# Altium project SAMW25_Xplained_Pro.PrjPCB (part 1 of 2)
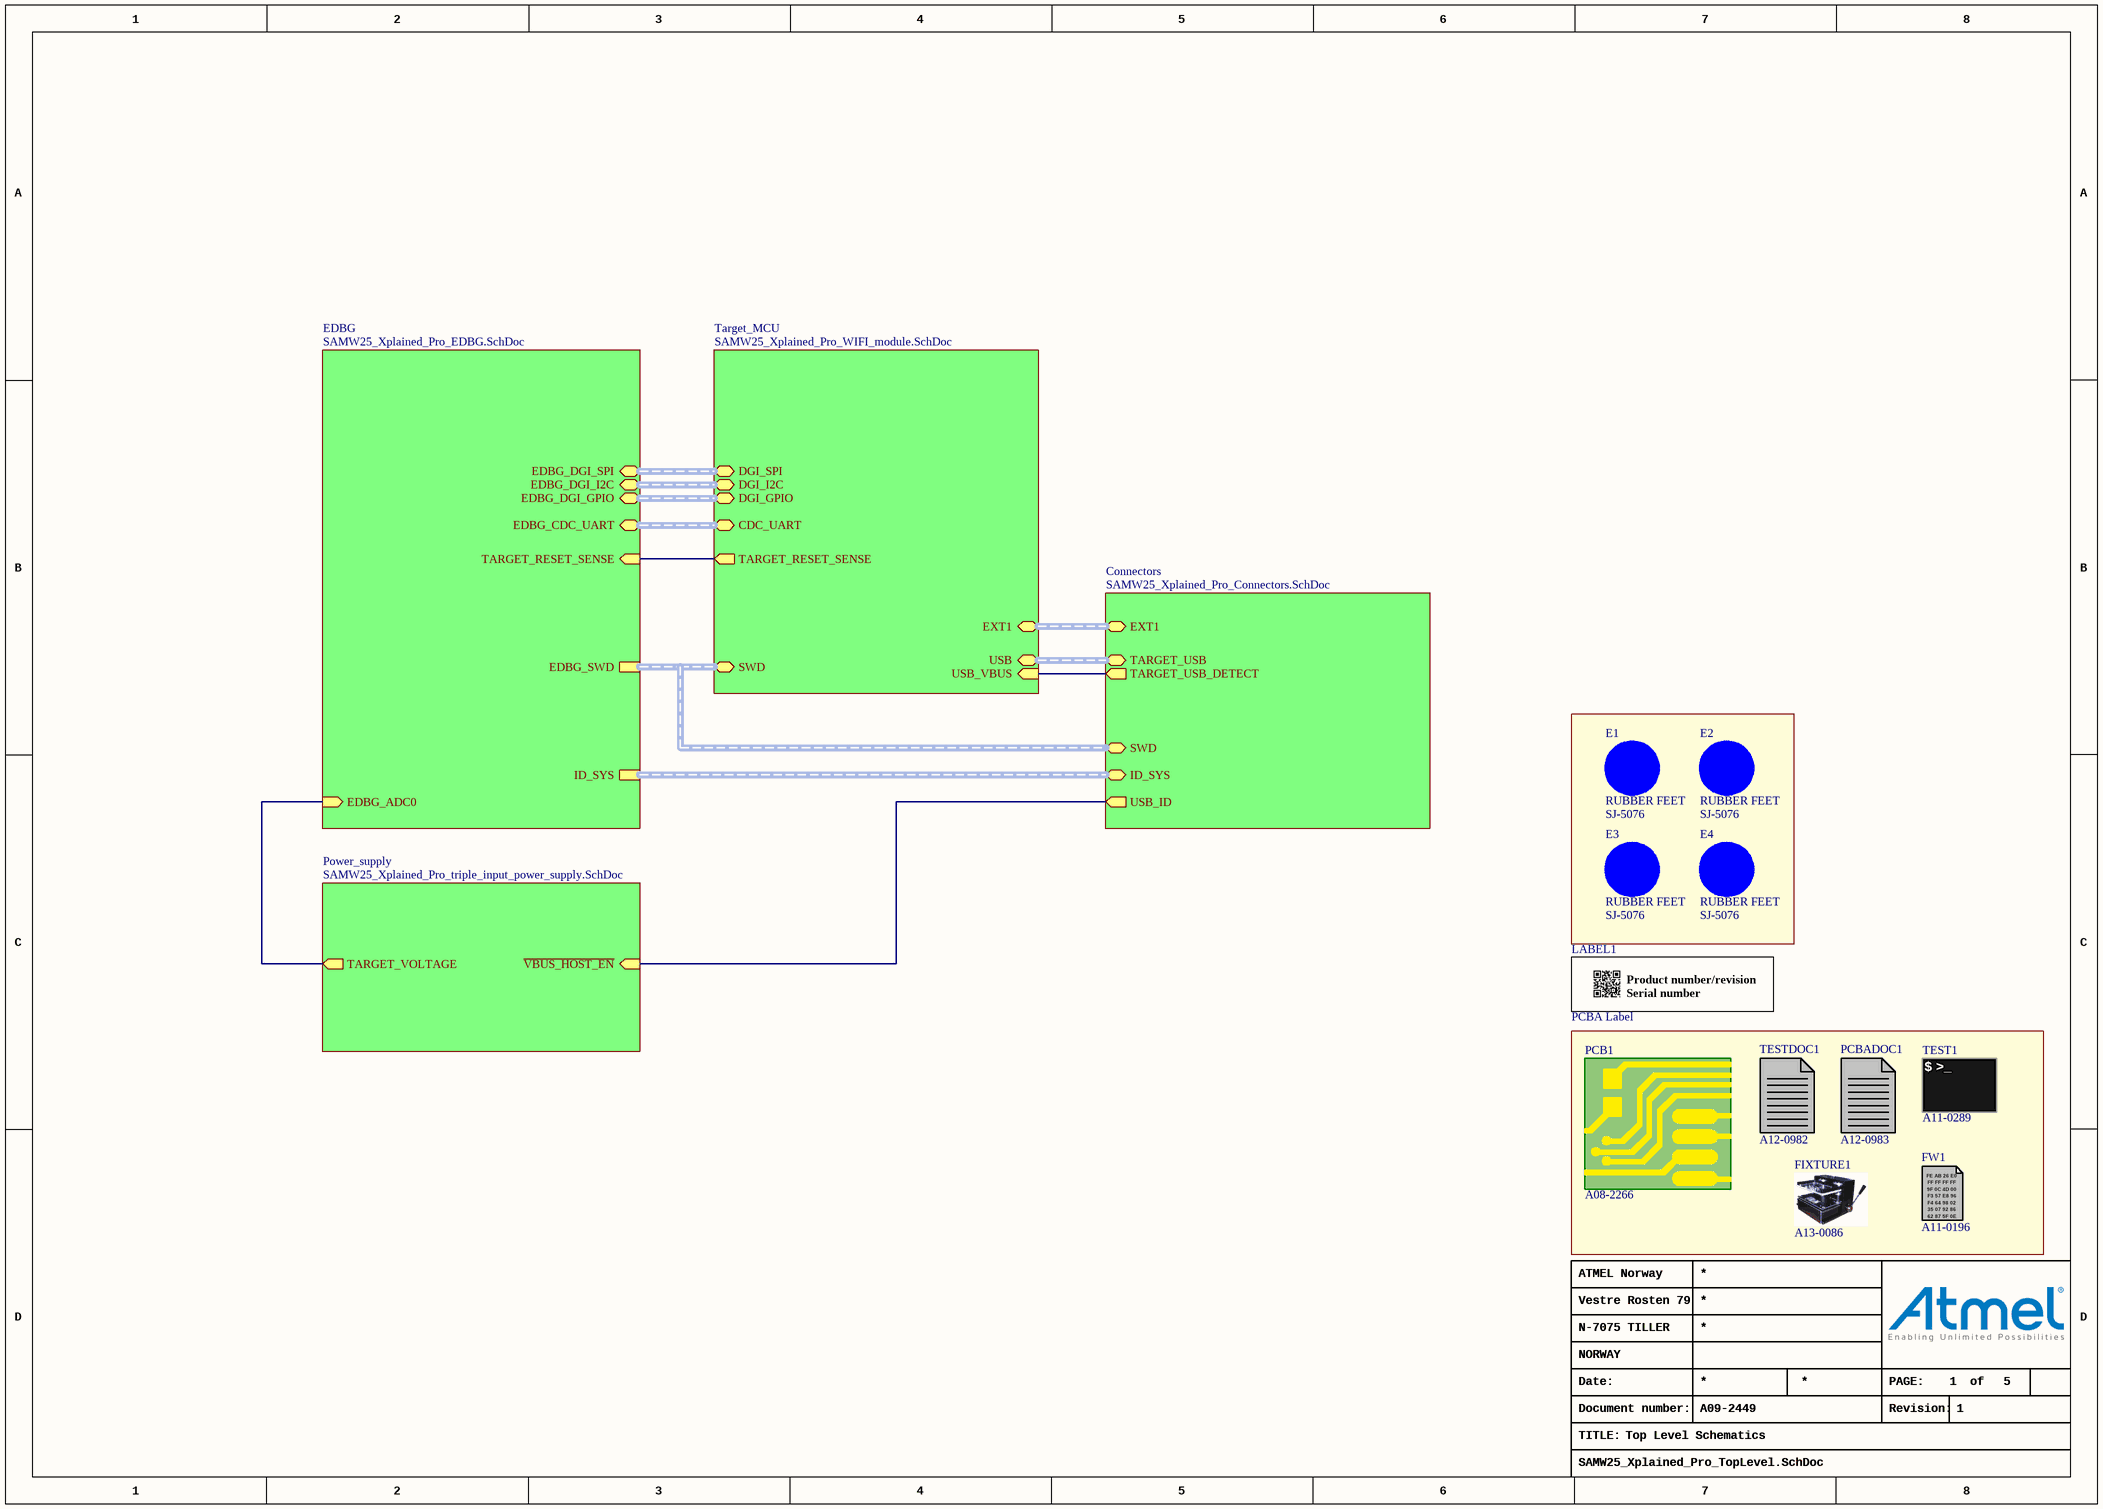
[diagram p0: SAMW25_Xplained_Pro_TopLevel.SchDoc]
5 sheets, 145 parts. Net scope: hierarchical (ports join the sheet entries above them; power ports are global).
Board file: SAMW25_Xplained_Pro.PcbDoc
Sheets:
  SAMW25_Xplained_Pro_TopLevel.SchDoc
    Target_MCU = SAMW25_Xplained_Pro_WIFI_module.SchDoc
    EDBG = SAMW25_Xplained_Pro_EDBG.SchDoc
    Connectors = SAMW25_Xplained_Pro_Connectors.SchDoc
    Power_supply = SAMW25_Xplained_Pro_triple_input_power_supply.SchDoc

## Sheet SAMW25_Xplained_Pro_TopLevel.SchDoc: Top Level Schematics
size A3; Organization: ATMEL Norway; Address1: Vestre Rosten 79; Address2: N-7075 TILLER; Address3: NORWAY; DocumentNumber: A09-2449; Revision: 1; SheetNumber: 1; SheetTotal: 5; PageSetup: Record=PageOptions|CenterHorizontal=True|CenterVertical=True|PrintScale=1.01|XCorrection=1.00|YCorrection=1.00|PrintKind=1|BorderSize=5000000|LeftOffset=0|BottomOffset=0|Orientation=2|PaperLength=1000|PaperWidth=1000|Scale=100|PaperSource=7|PrintQuality=-4|MediaType=1|DitherType=10|PaperKind=Letter|PrintScaleMode=1

### Parts
E1  RUBBER FEET  value SJ-5076  [AP8-00192]
E2  RUBBER FEET  value SJ-5076  [AP8-00192]
E3  RUBBER FEET  value SJ-5076  [AP8-00192]
E4  RUBBER FEET  value SJ-5076  [AP8-00192]
FIXTURE1  AN: A13-0086  (hidden comment: JIG)  (mechanical)
FW1  AN: A11-0196  (hidden comment: FW)  (mechanical)
LABEL1  value PCBA Label  [AP8-00317]  (hidden comment: PCBA_LABEL)
PCB1  AN: A08-2266  (hidden comment: PCB)  (mechanical)
PCBADOC1  AN: A12-0983  (hidden comment: PCBADOC)  (mechanical)
TEST1  AN: A11-0289  (hidden comment: TEST)  (mechanical)
TESTDOC1  AN: A12-0982  (hidden comment: TESTDOC)  (mechanical)

### Sub-sheets
Connectors = SAMW25_Xplained_Pro_Connectors.SchDoc: ID_SYS (harness ID_SYS), EXT1 (harness EXT), TARGET_USB (harness USB), TARGET_USB_DETECT (out), USB_ID (out), SWD (harness SWD)
EDBG = SAMW25_Xplained_Pro_EDBG.SchDoc: ID_SYS (harness ID_SYS), EDBG_SWD (harness SWD), EDBG_CDC_UART (harness CDC_UART), EDBG_DGI_I2C (harness DGI_I2C), EDBG_DGI_SPI (harness DGI_SPI), EDBG_DGI_GPIO (harness DGI_GPIO), TARGET_RESET_SENSE (in), EDBG_ADC0 (in)
Power_supply = SAMW25_Xplained_Pro_triple_input_power_supply.SchDoc: TARGET_VOLTAGE (out), ~{VBUS_HOST_EN} (in)
Target_MCU = SAMW25_Xplained_Pro_WIFI_module.SchDoc: SWD (harness SWD), DGI_SPI (harness DGI_SPI), DGI_I2C (harness DGI_I2C), DGI_GPIO (harness DGI_GPIO), CDC_UART (harness CDC_UART), TARGET_RESET_SENSE (out), EXT1 (harness EXT), USB (harness USB), USB_VBUS (in)

### Nets
EDBG_ADC0: sheet EDBG/EDBG_ADC0, sheet Power_supply/TARGET_VOLTAGE
PA05_ADC5: sheet Target_MCU/USB_VBUS, sheet Connectors/TARGET_USB_DETECT
TARGET_RESET_SENSE: sheet Target_MCU/TARGET_RESET_SENSE, sheet EDBG/TARGET_RESET_SENSE
TARGET_USB_ID: sheet Connectors/USB_ID, sheet Power_supply/~{VBUS_HOST_EN}

Not connected (* = marked no-connect by the designer): E1 1(FIDUCIAL); E2 1(FIDUCIAL); E3 1(FIDUCIAL); E4 1(FIDUCIAL)

### Buses and harness runs
harness sheet Connectors/EXT1 = sheet Target_MCU/EXT1
harness sheet Connectors/ID_SYS = sheet EDBG/ID_SYS
harness sheet Connectors/SWD = sheet EDBG/EDBG_SWD = sheet Target_MCU/SWD
harness sheet Connectors/TARGET_USB = sheet Target_MCU/USB
harness sheet EDBG/EDBG_CDC_UART = sheet Target_MCU/CDC_UART
harness sheet EDBG/EDBG_DGI_GPIO = sheet Target_MCU/DGI_GPIO
harness sheet EDBG/EDBG_DGI_I2C = sheet Target_MCU/DGI_I2C
harness sheet EDBG/EDBG_DGI_SPI = sheet Target_MCU/DGI_SPI

### Notes on the sheet
- Date:
- PAGE:
- of
- TITLE:
- Document number:
- Revision:
- (in symbol A09-0611) / Product number/revision / Serial number
- (in symbol A11-0196) FE AB 26 E0; FF FF FF FF; 9F 0C 4D 00; F3 57 E8 96; F4 64 98 02; 35 07 92 86; 62 87 5F 0E
- (in symbol A11-0289) $ >_

### Library data of the parts
E1-E4 = A08-0053: 2.8mm adhesive feet,diam 8.0mm; PartGroup: Mechanical devices,Mounting accessories; Manufacturer: 3M; ComponentStatus: 'Active (verified)'; Verified date: 2006-05-05; Verified by: Ketil Skjerve; Status: Active; AN: A08-0053; Height: 2,79999995231628; MPN: SJ-5076; FootprintStatus: 'Active (Verified)'
FIXTURE1 = A13-0086: Xplained PRO MCU board Jupiter Test Fixture; PartGroup: Test Equipment,Test Fixtures; Manufacturer: ESCATEC; ComponentStatus: 'Active (verified)'; Value: Xplained PRO MCU board Jupiter Test Fixture; MPN: Xplained PRO MCU board Jupiter Test Fixture
FW1 = A11-0196: EDBG secured firmware; PartGroup: Software,Firmware,Tools; Manufacturer: ATMEL; ComponentStatus: 'Active (verified)'; Value: EDBG secured firmware
LABEL1 = A09-0611: PCBA identification label PP Top White Gloss; PartGroup: Mechanical devices,Packaging materials,Printed Labels; Manufacturer: ACT Logimark AS; MPN: 505462; ComponentStatus: 'Active (verified)'; AN: A09-0611; Status: New; FootprintStatus: 'Active (Verified)'
PCB1 = A08-2266: SAM W25 Xplained Pro PCB documentation; PartGroup: Mechanical devices,Printed circuit boards; ComponentStatus: 'New (not verified)'; Value: SAM W25 Xplained Pro PCB documentation
PCBADOC1 = A12-0983: SAM W25 Xplained Pro PCBA documentation; PartGroup: Documentation,PCBA Documents,Atmel; Value: A09-2449 PCBA Files; ComponentStatus: 'New (not verified)'
TEST1 = A11-0289: Fixture test for SAM W25 Xplained Pro; PartGroup: Software,Test software,Starter Kit; Value: SAM W25 Xplained Pro test; ComponentStatus: 'New (not verified)'
TESTDOC1 = A12-0982: SAM W25 Xplained Pro test Instructions; PartGroup: Documentation,Procedures,Test Instructions; ComponentStatus: 'New (not verified)'; Value: SAM W25 Xplained Pro test Instructions

## Sheet SAMW25_Xplained_Pro_WIFI_module.SchDoc: Target MCU
size A3; Organization: ATMEL Norway; Address1: Vestre Rosten 79; Address2: N-7075 TILLER; Address3: NORWAY; DocumentNumber: A09-2449; Revision: 1; SheetNumber: 3; SheetTotal: 5; PageSetup: Record=PageOptions|CenterHorizontal=True|CenterVertical=True|PrintScale=1.01|XCorrection=1.00|YCorrection=1.00|PrintKind=1|BorderSize=5000000|LeftOffset=0|BottomOffset=0|Orientation=2|PaperLength=1000|PaperWidth=1000|Scale=100|PaperSource=7|PrintQuality=-4|MediaType=1|DitherType=10|PaperKind=A3 (297 x 420 mm)|PrintScaleMode=1
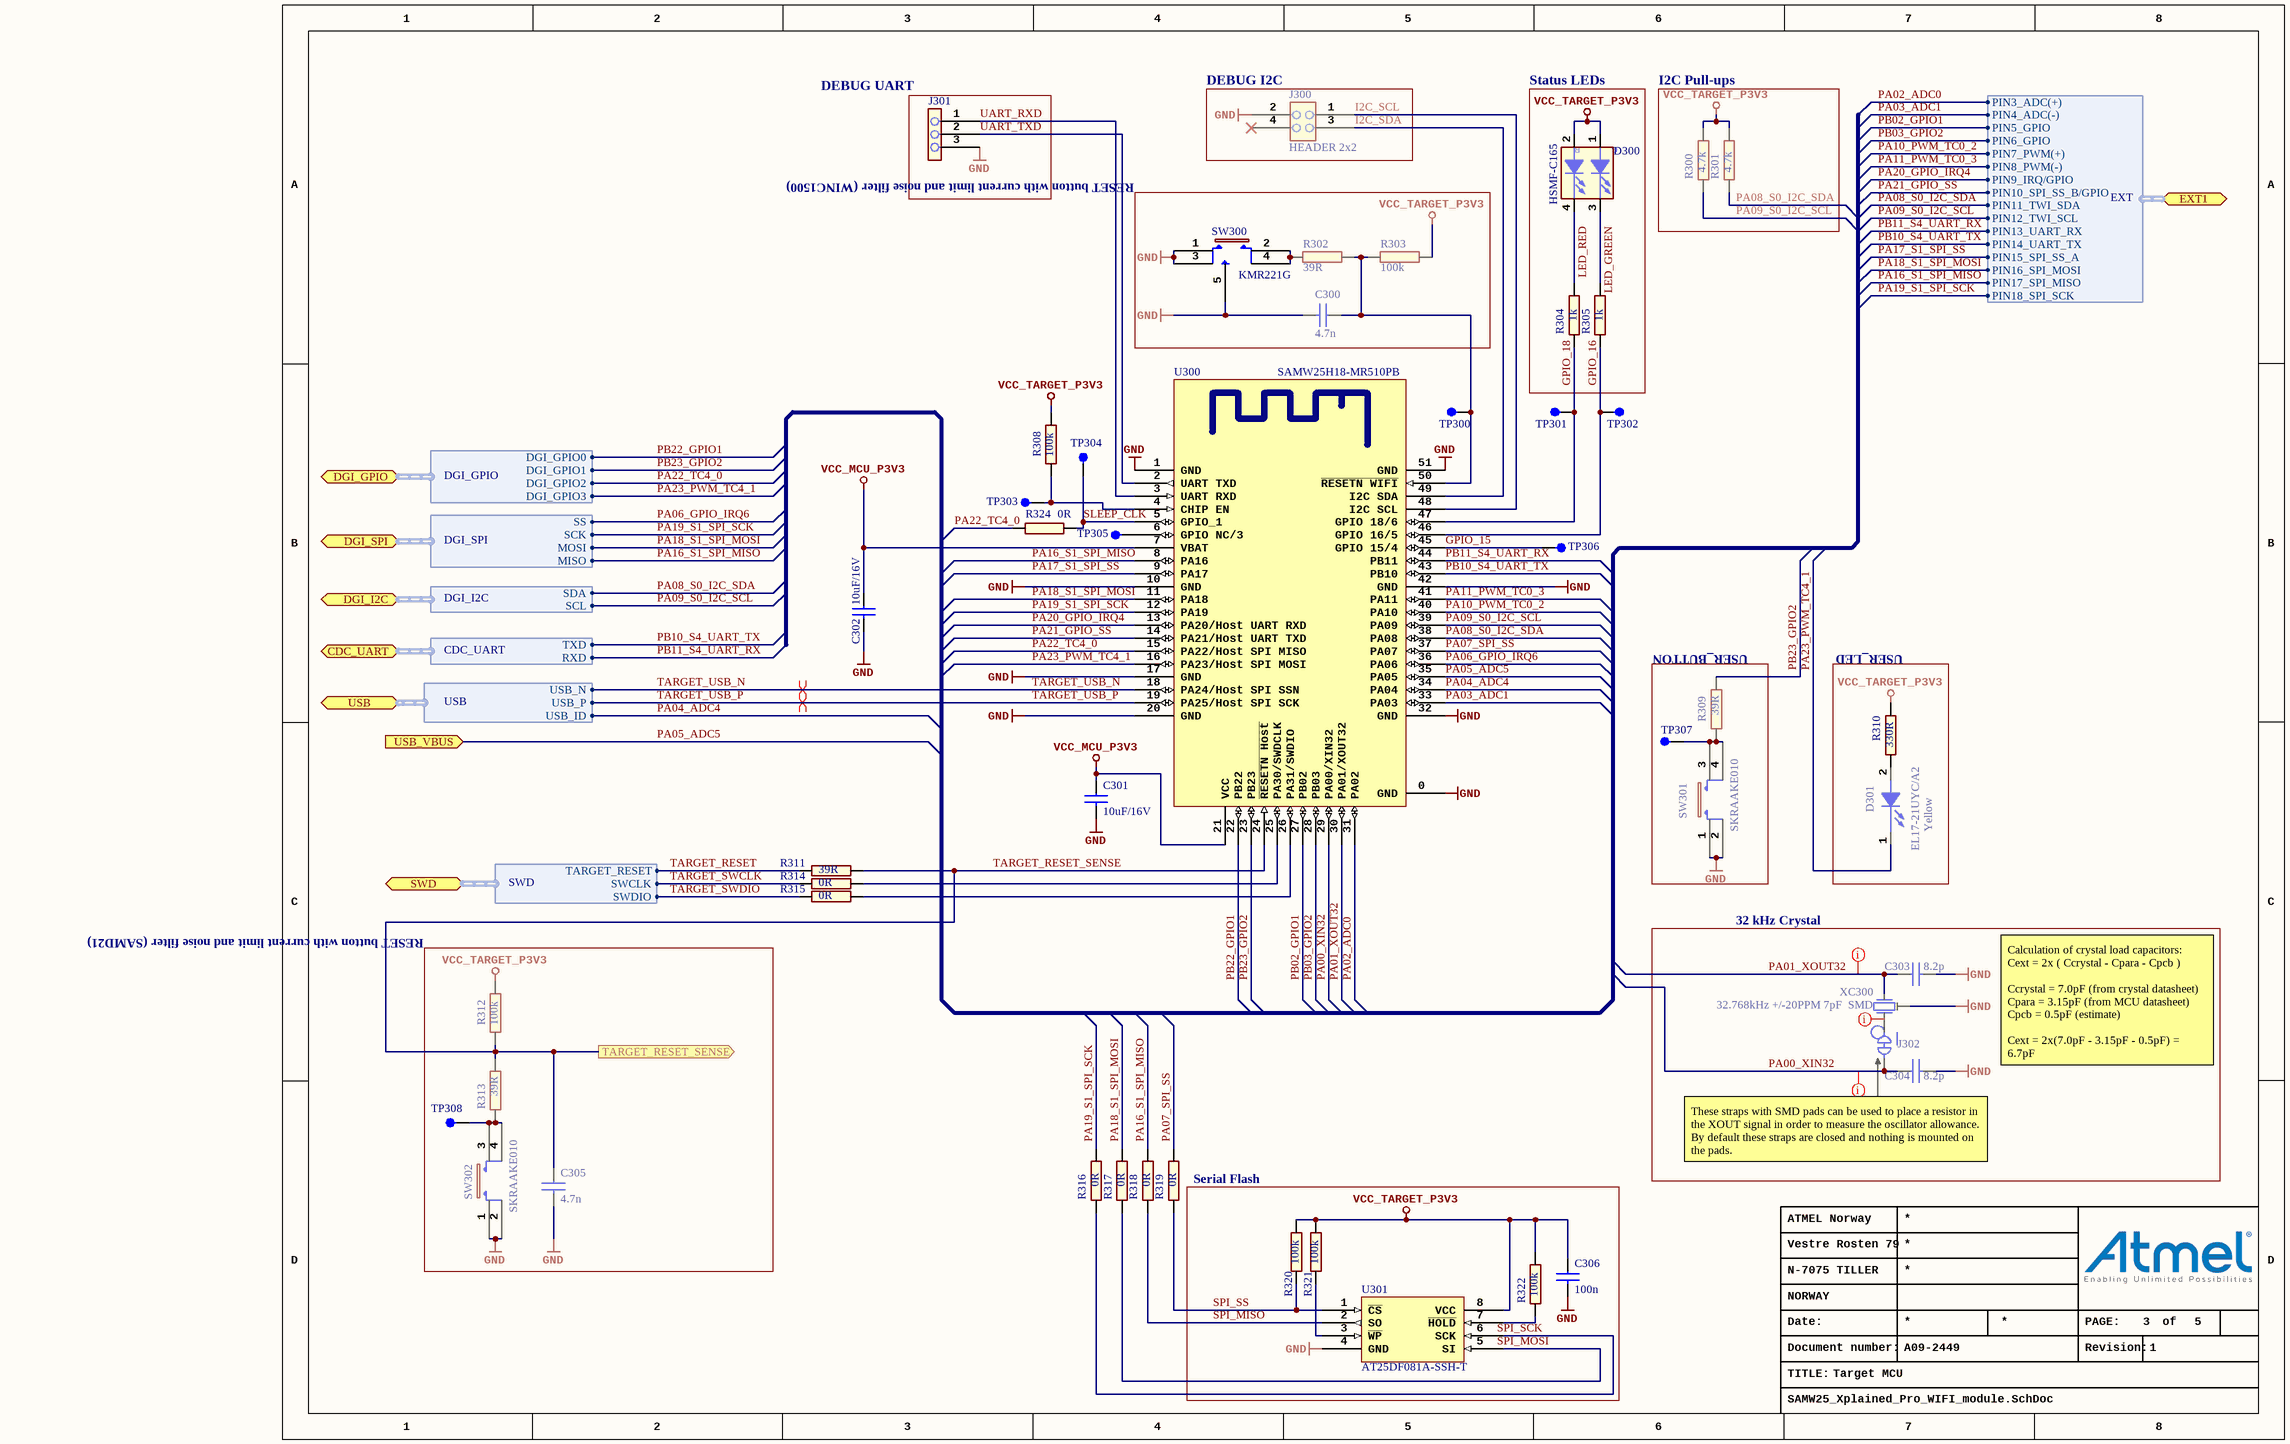
[diagram p1: SAMW25_Xplained_Pro_WIFI_module.SchDoc]

### Parts
C300  4.7n  [AP1-00001]
C301  value 10uF/16V  [AP1-00039]  (hidden comment: CAP-NONPOL)
C302  value 10uF/16V  [AP1-00039]  (hidden comment: CAP-NONPOL)
C303  value 8.2p  [AP1-00001]  (hidden comment: CAP-NONPOL)
C304  value 8.2p  [AP1-00001]  (hidden comment: CAP-NONPOL)
C305  4.7n  [AP1-00053]
C306  100n  [AP1-00001]
D300  value HSMF-C165  [AP4-00132]  (hidden comment: LED2_2)
D301  Yellow  value EL17-21UYC/A2  [AP4-00013]
J300  HEADER 2x2  [AP8-00179]
J301  Same as A08-1614 but with 1mm hole for optimal reflow soldering (no misalignment of the component)  [AP8-00745]  (value not drawn)
J302  SMD-STRAP_CLOSED  [AP8-00595]  (value not drawn)  (net tie, no BOM)
R300  value 4.7k  [AP2-00000]  (hidden comment: R2)
R301  value 4.7k  [AP2-00000]  (hidden comment: R2)
R302  value 39R  [AP2-00000]  (hidden comment: R2)
R303  value 100k  [AP2-00000]  (hidden comment: R2)
R304  value 1k  [AP2-00000]  (hidden comment: R2)
R305  value 1k  [AP2-00000]  (hidden comment: R2)
R308  value 100k  [AP2-00000]  (hidden comment: R2)
R309  value 39R  [AP2-00011]  (hidden comment: R2)
R310  value 330R  [AP2-00000]  (hidden comment: R2)
R311  value 39R  [AP2-00011]  (hidden comment: R2)
R312  value 100k  [AP2-00011]  (hidden comment: R2)
R313  value 39R  [AP2-00011]  (hidden comment: R2)
R314  value 0R  [AP2-00000]  (hidden comment: R2)
R315  value 0R  [AP2-00000]  (hidden comment: R2)
R316  value 0R  [AP2-00000]  (hidden comment: R2)
R317  value 0R  [AP2-00000]  (hidden comment: R2)
R318  value 0R  [AP2-00000]  (hidden comment: R2)
R319  value 0R  [AP2-00000]  (hidden comment: R2)
R320  value 100k  [AP2-00000]  (hidden comment: R2)
R321  value 100k  [AP2-00000]  (hidden comment: R2)
R322  value 100k  [AP2-00000]  (hidden comment: R2)
R324  value 0R  [AP2-00011]  (hidden comment: R2)
SW300  value KMR221G  [AP8-00274]  (hidden comment: PUSHBUTTON2)
SW301  value SKRAAKE010  [AP8-00137]  (hidden comment: Can be ordered in low volumes from Mouser)
SW302  value SKRAAKE010  [AP8-00137]  (hidden comment: Can be ordered in low volumes from Mouser)
TP300  TESTPOINT  [AP8-00256]  (value not drawn)  (no BOM)
TP301  TESTPOINT  [AP8-00256]  (value not drawn)  (no BOM)
TP302  TESTPOINT  [AP8-00256]  (value not drawn)  (no BOM)
TP303  TESTPOINT  [AP8-00256]  (value not drawn)  (no BOM)
TP304  TESTPOINT  [AP8-00256]  (value not drawn)  (no BOM)
TP305  TESTPOINT  [AP8-00256]  (value not drawn)  (no BOM)
TP306  TESTPOINT  [AP8-00256]  (value not drawn)  (no BOM)
TP307  TESTPOINT  [AP8-00010]  (value not drawn)  (no BOM)
TP308  TESTPOINT  [AP8-00010]  (value not drawn)  (no BOM)
U300  value SAMW25H18-MR510PB  [AP9-00132]  (hidden comment: MR210PA)
U301  value AT25DF081A-SSH-T  [AP8-00417]  (hidden comment: AT25DF081A)
XC300  value 32.768kHz +/-20PPM 7pF  SMD  [AP7-00044]  (hidden comment: Farnell order no:1539364)

### Blocks framed on the sheet
DEBUG I2C: J300
Status LEDs: D300 R304 R305
I2C Pull-ups: R300 R301
RESET button with current limit and noise filter (WINC1500): C300 R302 R303 SW300
USER_BUTTON: R309 SW301 TP307
USER_LED: D301 R310
RESET button with current limit and noise filter (SAMD21): C305 R312 R313 SW302 TP308
32 kHz Crystal: C303 C304 J302 XC300
Serial Flash: C306 R320-R322 U301

### Ports
CDC_UART (harness CDC_UART), DGI_GPIO (harness DGI_GPIO), DGI_I2C (harness DGI_I2C), DGI_SPI (harness DGI_SPI), EXT1 (harness EXT), SWD (harness SWD), TARGET_RESET_SENSE (out), USB (harness USB), USB_VBUS (in)

### Harnesses
DGI_GPIO: DGI_GPIO0, DGI_GPIO1, DGI_GPIO2, DGI_GPIO3
DGI_SPI: MISO, MOSI, SCK, SS
DGI_I2C: SCL, SDA
CDC_UART: RXD, TXD
SWD: SWCLK, SWDIO, TARGET_RESET
USB: USB_ID, USB_N, USB_P
EXT: PIN10_SPI_SS_B/GPIO, PIN11_TWI_SDA, PIN12_TWI_SCL, PIN13_UART_RX, PIN14_UART_TX, PIN15_SPI_SS_A, PIN16_SPI_MOSI, PIN17_SPI_MISO, PIN18_SPI_SCK, PIN3_ADC(+), PIN4_ADC(-), PIN5_GPIO, PIN6_GPIO, PIN7_PWM(+), PIN8_PWM(-), PIN9_IRQ/GPIO

### Nets
GND: C300.2 C301.2 C302.2 C303.2 C304.2 C305.2 C306.2 J300.2 J301.3 SW300.1 SW300.3 SW300.5(GND) SW301.1 SW301.2 SW302.1 SW302.2 U300.0(GND) U300.1(GND) U300.10(GND) U300.17(GND) U300.20(GND) U300.32(GND) U300.42(GND) U300.51(GND) U301.4(GND) XC300.3
VCC_MCU_P3V3: C301.1 C302.1 U300.7(VBAT) U300.21(VCC)
VCC_TARGET_P3V3: C306.1 D300.1(ANODE1) D300.2(ANODE2) R300.1 R301.1 R303.2 R308.2 R310.2 R312.2 R320.1 R321.1 R322.2 U301.8(VCC)
GPIO_15: TP306.1 U300.45(GPIO_15/4)
GPIO_16: R305.2 TP302.1 U300.46(GPIO_16/5)
GPIO_18: R304.2 TP301.1 U300.47(GPIO_18/6)
I2C_SCL: J300.1 U300.48(I2C_SCL)
I2C_SDA: J300.3 U300.49(I2C_SDA)
LED_GREEN: D300.3(CATHODE3) R305.1
LED_RED: D300.4(CATHODE4) R304.1
PA00_XIN32: C304.1 J302.2 U300.29(PA00/XIN32)
PA01_XOUT32: C303.1 U300.30(PA01/XOUT32) XC300.1
PA02_ADC0: U300.31(PA02) ; port EXT1.PIN3_ADC(+)
PA03_ADC1: U300.33(PA03) ; port EXT1.PIN4_ADC(-)
PA04_ADC4: U300.34(PA04) ; port USB.USB_ID
PA05_ADC5: U300.35(PA05) ; port USB_VBUS
PA06_GPIO_IRQ6: U300.36(PA06) ; port DGI_SPI.SS  [project net EDBG_SPI_DGI_SS]
PA07_SPI_SS: R319.2 U300.37(PA07)
PA08_S0_I2C_SDA: R301.2 U300.38(PA08) ; port DGI_I2C.SDA, port EXT1.PIN11_TWI_SDA  [project net EDBG_DGI_SDA]
PA09_S0_I2C_SCL: R300.2 U300.39(PA09) ; port DGI_I2C.SCL, port EXT1.PIN12_TWI_SCL  [project net EDBG_DGI_SCL]
PA10_PWM_TC0_2: U300.40(PA10) ; port EXT1.PIN7_PWM(+)
PA11_PWM_TC0_3: U300.41(PA11) ; port EXT1.PIN8_PWM(-)
PA16_S1_SPI_MISO: R318.2 U300.8(PA16) ; port DGI_SPI.MISO, port EXT1.PIN17_SPI_MISO
PA17_S1_SPI_SS: U300.9(PA17) ; port EXT1.PIN15_SPI_SS_A
PA18_S1_SPI_MOSI: R317.2 U300.11(PA18) ; port DGI_SPI.MOSI, port EXT1.PIN16_SPI_MOSI  [project net EDBG_SPI_DGI_MOSI]
PA19_S1_SPI_SCK: R316.2 U300.12(PA19) ; port DGI_SPI.SCK, port EXT1.PIN18_SPI_SCK  [project net EDBG_SPI_DGI_SCK]
PA20_GPIO_IRQ4: U300.13(PA20/Host_UART_RXD) ; port EXT1.PIN9_IRQ/GPIO
PA21_GPIO_SS: U300.14(PA21/Host_UART_TXD) ; port EXT1.PIN10_SPI_SS_B/GPIO
PA22_TC4_0: R324.1 U300.15(PA22/Host_SPI_MISO) ; port DGI_GPIO.DGI_GPIO2
PA23_PWM_TC4_1: D301.1(CATHODE) U300.16(PA23/Host_SPI_MOSI) ; port DGI_GPIO.DGI_GPIO3
PB02_GPIO1: U300.27(PB02) ; port EXT1.PIN5_GPIO
PB03_GPIO2: U300.28(PB03) ; port EXT1.PIN6_GPIO
PB10_S4_UART_TX: U300.43(PB10) ; port CDC_UART.TXD, port EXT1.PIN14_UART_TX  [project net EDBG_CDC_USART_RX]
PB11_S4_UART_RX: U300.44(PB11) ; port CDC_UART.RXD, port EXT1.PIN13_UART_RX
PB22_GPIO1: U300.22(PB22) ; port DGI_GPIO.DGI_GPIO0
PB23_GPIO2: R309.2 U300.23(PB23) ; port DGI_GPIO.DGI_GPIO1
SLEEP_CLK: R324.2 TP304.1 U300.5(GPIO_1)
SPI_MISO: R318.1 U301.2(SO)
SPI_SS: R319.1 R320.2 U301.1(~{CS})
TARGET_RESET: R311.1 ; port SWD.TARGET_RESET
TARGET_RESET_SENSE: C305.1 R311.2 R312.1 R313.2 U300.24(~{RESETN_Host}) ; port TARGET_RESET_SENSE
TARGET_SWCLK: R314.1 ; port SWD.SWCLK  [project net SWCLK]
TARGET_SWDIO: R315.1 ; port SWD.SWDIO  [project net SWDIO]
TARGET_USB_N: U300.18(PA24/Host_SPI_SSN) ; port USB.USB_N
TARGET_USB_P: U300.19(PA25/Host_SPI_SCK) ; port USB.USB_P
UART_RXD: J301.1 U300.3(UART_RXD)
UART_TXD: J301.2 U300.2(UART_TXD)
NetC300_1: C300.1 R302.2 R303.1 TP300.1 U300.50(~{RESETN_WIFI})
NetD301_2: D301.2(ANODE) R310.1
NetJ302_1: J302.1 XC300.2
NetR302_1: R302.1 SW300.2 SW300.4
NetR308_1: R308.1 TP303.1 U300.4(CHIP_EN)
NetR309_1: R309.1 SW301.3 SW301.4 TP307.1
NetR313_1: R313.1 SW302.3 SW302.4 TP308.1
NetR314_2: R314.2 U300.25(PA30/SWDCLK)
NetR315_2: R315.2 U300.26(PA31/SWDIO)
NetR316_1: R316.1 U301.6(SCK)
NetR317_1: R317.1 U301.5(SI)
NetR321_2: R321.2 U301.3(~{WP})
NetR322_1: R322.1 U301.7(~{HOLD})
NetTP305_1: TP305.1 U300.6(GPIO_NC/3)

Not connected (* = marked no-connect by the designer): J300 4*

### Layout directives
rule Assembly Testpoint Usage [Testpoint - Not Allowed    Multiple - Not Allowed]: NetJ302_1, PA00_XIN32, PA01_XOUT32
differential pair; rule Assembly Testpoint Usage [Testpoint - Not Allowed    Multiple - Not Allowed]: TARGET_USB_N, TARGET_USB_P

### Notes on the sheet
- (near J301) DEBUG UART
- Calculation of crystal load capacitors:
  Cext = 2x ( Ccrystal - Cpara - Cpcb )
  Ccrystal = 7.0pF (from crystal datasheet)
  Cpara = 3.15pF (from MCU datasheet)
  Cpcb = 0.5pF (estimate)
  Cext = 2x(7.0pF - 3.15pF - 0.5pF) = 6.7pF
- These straps with SMD pads can be used to place a resistor in the XOUT signal in order to measure the oscillator allowance.
  By default these straps are closed and nothing is mounted on the pads.
- Labels drawn without touching a wire or pin: SPI_MOSI, SPI_SCK
- Date:
- PAGE:
- of
- TITLE:
- Document number:
- Revision:
- (in symbol A10-0154) R; G

### Library data of the parts
C300 C305 = A01-0539: Ceramic capacitor, SMD 0402, X7R, 16V, +/-10 %; PartGroup: Capacitors,Ceramic,SMD 0402; Manufacturer: NIC Components Corp.; MPN: NMC0402X7R472K25TRPF; TemperatureRange: -55°C to +125°C; ComponentStatus: 'Active (verified)'; Status: Active; Verified by: Lars Helge Mo; Verified date: 2005-12-15; AN: A01-0539; Value: 4.7n; Height: 0.600000023841858; FootprintStatus: 'Active (Verified)'
C301 C302 = A01-0491: Ceramic capacitor, SMD 0603, X5R, 16V, 10UF ± 20% (High Density); PartGroup: Capacitors,Ceramic,SMD 0603; Manufacturer: Taiyo Yuden; MPN: EMK107BBJ106MA-T; Tolerance: ­± 20%; TemperatureRange: -55°C to +85°C; ComponentStatus: 'Active (verified)'; Status: Active; Verified by: Lars Helge Mo; Verified date: 2005-12-15; AN: A01-0491; Height: 0.819999992847443; FootprintStatus: 'Active (Verified)'
C303 C304 = A01-0014: Ceramic capacitor, SMD 0402, NP0, 50V, +/-5%; PartGroup: Capacitors,Ceramic,SMD 0402; TemperatureRange: -55 - +125 deg C; ComponentStatus: 'Active (verified)'; Status: Active; Verified by: Lars Helge Mo; Verified date: 2005-12-15; AN: A01-0014; Tolerance: 50V, +/-5%; Height: 0.550000011920929; FootprintStatus: 'Active (Verified)'
C306 = A01-0246: Ceramic capacitor, SMD 0402, X7R, 16V, +/-10%; PartGroup: Capacitors,Ceramic,SMD 0402; Manufacturer: Kemet; MPN: C0402C104K4RACTU; TemperatureRange: -55 - +125 deg C; ComponentStatus: 'Active (verified)'; Status: Active; Verified by: Lars Helge Mo; Verified date: 2005-12-15; AN: A01-0246; Value: 100n; Tolerance: 16V, +/-10%; Height: 0,5; FootprintStatus: 'Active (Verified)'
D300 = A10-0154: LED, Bicolor, Red/Green, Diffused, 1.6 x 0.8 mm (0603); PartGroup: Opto,LEDs,SMD; Manufacturer: Avago Technologies; TemperatureRange: -30Â°C to 85Â°C; ComponentStatus: 'Active (verified)'; AN: A10-0154; Height: 0.5; MPN: HSMF-C165; FootprintStatus: 'Active (Verified)'
D301 = A10-0019: LED, Yellow, Wave length=591nm, SMD 0805, ±70°; PartGroup: Opto,LEDs,SMD; Manufacturer: Everlight; MPN: 17-21UYC/S530-A3/TR8; TemperatureRange: -40 to +85 deg C; ComponentStatus: 'Active (verified)'; Verified date: 2006-02-17; Verified by: Sveinung Helgeland; Status: Active; AN: A10-0019; Height: 1,10000002384186; FootprintStatus: 'Active (Verified)'
J300 = A08-0115: 2x2 pin header, 2.54 mm pitch, Pin-in-Paste THM; PartGroup: Mechanical devices,Connectors,Pin headers; Manufacturer: Freber; Value: CD0750142X2; ComponentStatus: 'Active (verified)'; Verified date: 2005-12-19; Verified by: Lars Helge Mo; Status: Active; AN: A08-0115; Height: 9.60000038146973; MPN: CD0750142X2; FootprintStatus: 'Active (Verified)'
J301 = A08-1799: 1x3 pin header, 2.54mm pitch, Pin-in-Paste THM, 1mm hole; PartGroup: Mechanical devices,Connectors,Pin headers; Manufacturer: SAMTEC; Value: HMTSW-103-23-F-S-237; ComponentStatus: 'Active (verified)'; Verified date: 2006-01-30; Verified by: Lars Helge Mo; Status: Active; AN: A08-1799; Height: 6.09999990463257; MPN: HMTSW-103-23-F-S-237; FootprintStatus: 'Active (Verified)'
J302 = A08-1454: Closed Link 0402; PartGroup: Mechanical devices,PCB implemented components; ComponentStatus: 'Active (verified)'; AN: A08-1454; Value: Closed Link; FootprintStatus: 'New (Not verified)'
R300 R301 = A02-0228: Thick film resistor, SMD 0402, 1/16W, 1%; PartGroup: Resistors,SMD,0402 1%; TemperatureRange: -55ï¿½ to +125ï¿½C; ComponentStatus: 'Active (verified)'; Status: Active; Verified by: Lars Helge Mo; Verified date: 2005-12-19; AN: A02-0228; Tolerance: 1 %; Height: 0,349999994039536; FootprintStatus: 'Active (Verified)'
R302 R309 R311 R313 = A02-0178: Thick film resistor, SMD 0402, 1/16W, 1%; PartGroup: Resistors,SMD,0402 1%; TemperatureRange: -55 - +125 deg C; ComponentStatus: 'Active (verified)'; Status: Active; Verified by: Lars Helge Mo; Verified date: 2005-12-19; AN: A02-0178; Tolerance: 1 %; Height: 0,349999994039536; FootprintStatus: 'Active (Verified)'
R303 R308 R312 R320-R322 = A02-0260: Thick film resistor, SMD 0402, 1/16W, 1%; PartGroup: Resistors,SMD,0402 1%; TemperatureRange: -55 - +125 deg C; ComponentStatus: 'Active (verified)'; Status: Active; Verified by: Lars Helge Mo; Verified date: 2005-12-19; AN: A02-0260; Tolerance: 1 %; Height: 0,349999994039536; FootprintStatus: 'Active (Verified)'
R304 R305 = A02-0212: Thick film resistor, SMD 0402, 1/16W, 1%; PartGroup: Resistors,SMD,0402 1%; TemperatureRange: -55 - +125 deg C; ComponentStatus: 'Active (verified)'; Status: Active; Verified by: Lars Helge Mo; Verified date: 2005-12-19; AN: A02-0212; Tolerance: 1 %; Height: 0.349999994039536; FootprintStatus: 'Active (Verified)'
R310 = A02-0200: Thick film resistor, SMD 0402, 1/16W, 1%; PartGroup: Resistors,SMD,0402 1%; TemperatureRange: -55 - +125 deg C; ComponentStatus: 'Active (verified)'; Status: Active; Verified by: Lars Helge Mo; Verified date: 2005-12-19; AN: A02-0200; Tolerance: 1 %; Height: 0.349999994039536; FootprintStatus: 'Active (Verified)'
R314-R319 = A02-0163: RES 0.0 OHM 1/16W 0402 SMD; PartGroup: Resistors,SMD,0402 1%; MPN: RMCF0402ZT0R00; Tolerance: 1 %; TemperatureRange: -55 - +125 deg C; ComponentStatus: 'Active (verified)'; Status: Active; Verified by: Lars Helge Mo; Verified date: 2005-12-19; AN: A02-0163; Height: 0.349999994039536; FootprintStatus: 'Active (Verified)'
R324 = A02-0163: Thick film resistor, SMD 0402, 1/16W, 1%; PartGroup: Resistors,SMD,0402 1%; TemperatureRange: -55 - +125 deg C; ComponentStatus: 'Active (verified)'; Status: Active; Verified by: Lars Helge Mo; Verified date: 2005-12-19; AN: A02-0163; Tolerance: 1 %; Height: 0.349999994039536; FootprintStatus: 'Active (Verified)'
SW300 = A08-0420: Microminiature Tact Switch for SMT; PartGroup: Mechanical devices,Switches,SMD; Manufacturer: ITT cannon; ComponentStatus: 'Active (verified)'; Status: Active; Verified by: Ketil Skjerve; Verified date: 2006-03-15; AN: A08-0420; Height: 1.89999997615814; MPN: KMR221G; FootprintStatus: 'Active (Verified)'
SW301 SW302 = A08-0790: 6.2x6.2 mm SMD tact switch, same as A08-0091 but less force is needed; PartGroup: Mechanical devices,Switches,SMD; Manufacturer: ALPS; TemperatureRange: -30 - +90 deg C; ComponentStatus: 'Active (verified)'; Status: Active; Verified by: Ketil Skjerve; Verified date: 2006-03-15; AN: A08-0790; Height: 5,09999990463257; MPN: SKRAAKE010; FootprintStatus: 'Active (Verified)'
TP300-TP306 = A09-0290: Hole for user grid with 1.27 mm pitch, 1x1 mm pad; PartGroup: Mechanical devices,PCB implemented components,PCB Screw Hole components; Value: Hole 0.65 mm; ComponentStatus: 'Active (verified)'; Status: Active; Verified by: Sveinung Helgeland; Verified date: 2006-02-17; AN: A09-0290; FootprintStatus: 'Active (Verified)'
TP307 TP308 = A08-0004: Single SMD testpad; PartGroup: Mechanical devices,Connectors,Test points; ComponentStatus: 'Active (verified)'; Status: Active; Verified by: Sveinung Helgeland; Verified date: 2006-02-17; AN: A08-0004; Height: 0; FootprintStatus: 'Active (Verified)'
U300 = A06-1267: IEEE 802.11 b/g/n module with onboard SAMD21G18A-MU and Crypto IC; PartGroup: Integrated Circuits,MCU, MPU, DSP,Other; Manufacturer: ATMEL; MPN: ATSAMW25H18-MR510PB; TemperatureRange: -20 to 85 C; ComponentStatus: 'Active (verified)'; AN: A06-1267; FootprintStatus: 'New (Not verified)'
U301 = A06-1051: 8Mbit SPI serial flash memory; PartGroup: Integrated Circuits,Memory,FLASH; Manufacturer: Adesto Technologies; TemperatureRange: -40°C to +85°C; ComponentStatus: 'Active (verified)'; AN: A06-1051; Height: 1.75; MPN: AT25DF081A-SSH-T; FootprintStatus: 'Active (Verified)'
XC300 = A07-0052: 32k768 crystal, +-20ppm, CL=7pF, max ESR 60kOhm, SMD; PartGroup: Frequency devices,Crystals,SMD; Manufacturer: Micro Crystal; MPN: MS1V-T1K 32.768kHz 7pF +/-20PPM TA; Tolerance: +/- 20 PPM; TemperatureRange: -40 /+85; ComponentStatus: 'Active (verified)'; AN: A07-0052; Height: 2,07999992370605; FootprintStatus: 'Active (Verified)'

## Sheet SAMW25_Xplained_Pro_EDBG.SchDoc: Embedded Debugger (EDBG)
size A3; Organization: ATMEL Norway; Address1: Vestre Rosten 79; Address2: N-7075 TILLER; Address3: NORWAY; DocumentNumber: A09-2449; Revision: 1; SheetNumber: 5; SheetTotal: 5; PageSetup: Record=PageOptions|CenterHorizontal=True|CenterVertical=True|PrintScale=0.73|XCorrection=1.00|YCorrection=1.00|PrintKind=1|BorderSize=5000000|LeftOffset=0|BottomOffset=0|Orientation=2|PaperLength=1000|PaperWidth=1000|Scale=100|PaperSource=7|PrintQuality=-4|MediaType=1|DitherType=10|PaperKind=A3 (297 x 420 mm)|PrintScaleMode=1
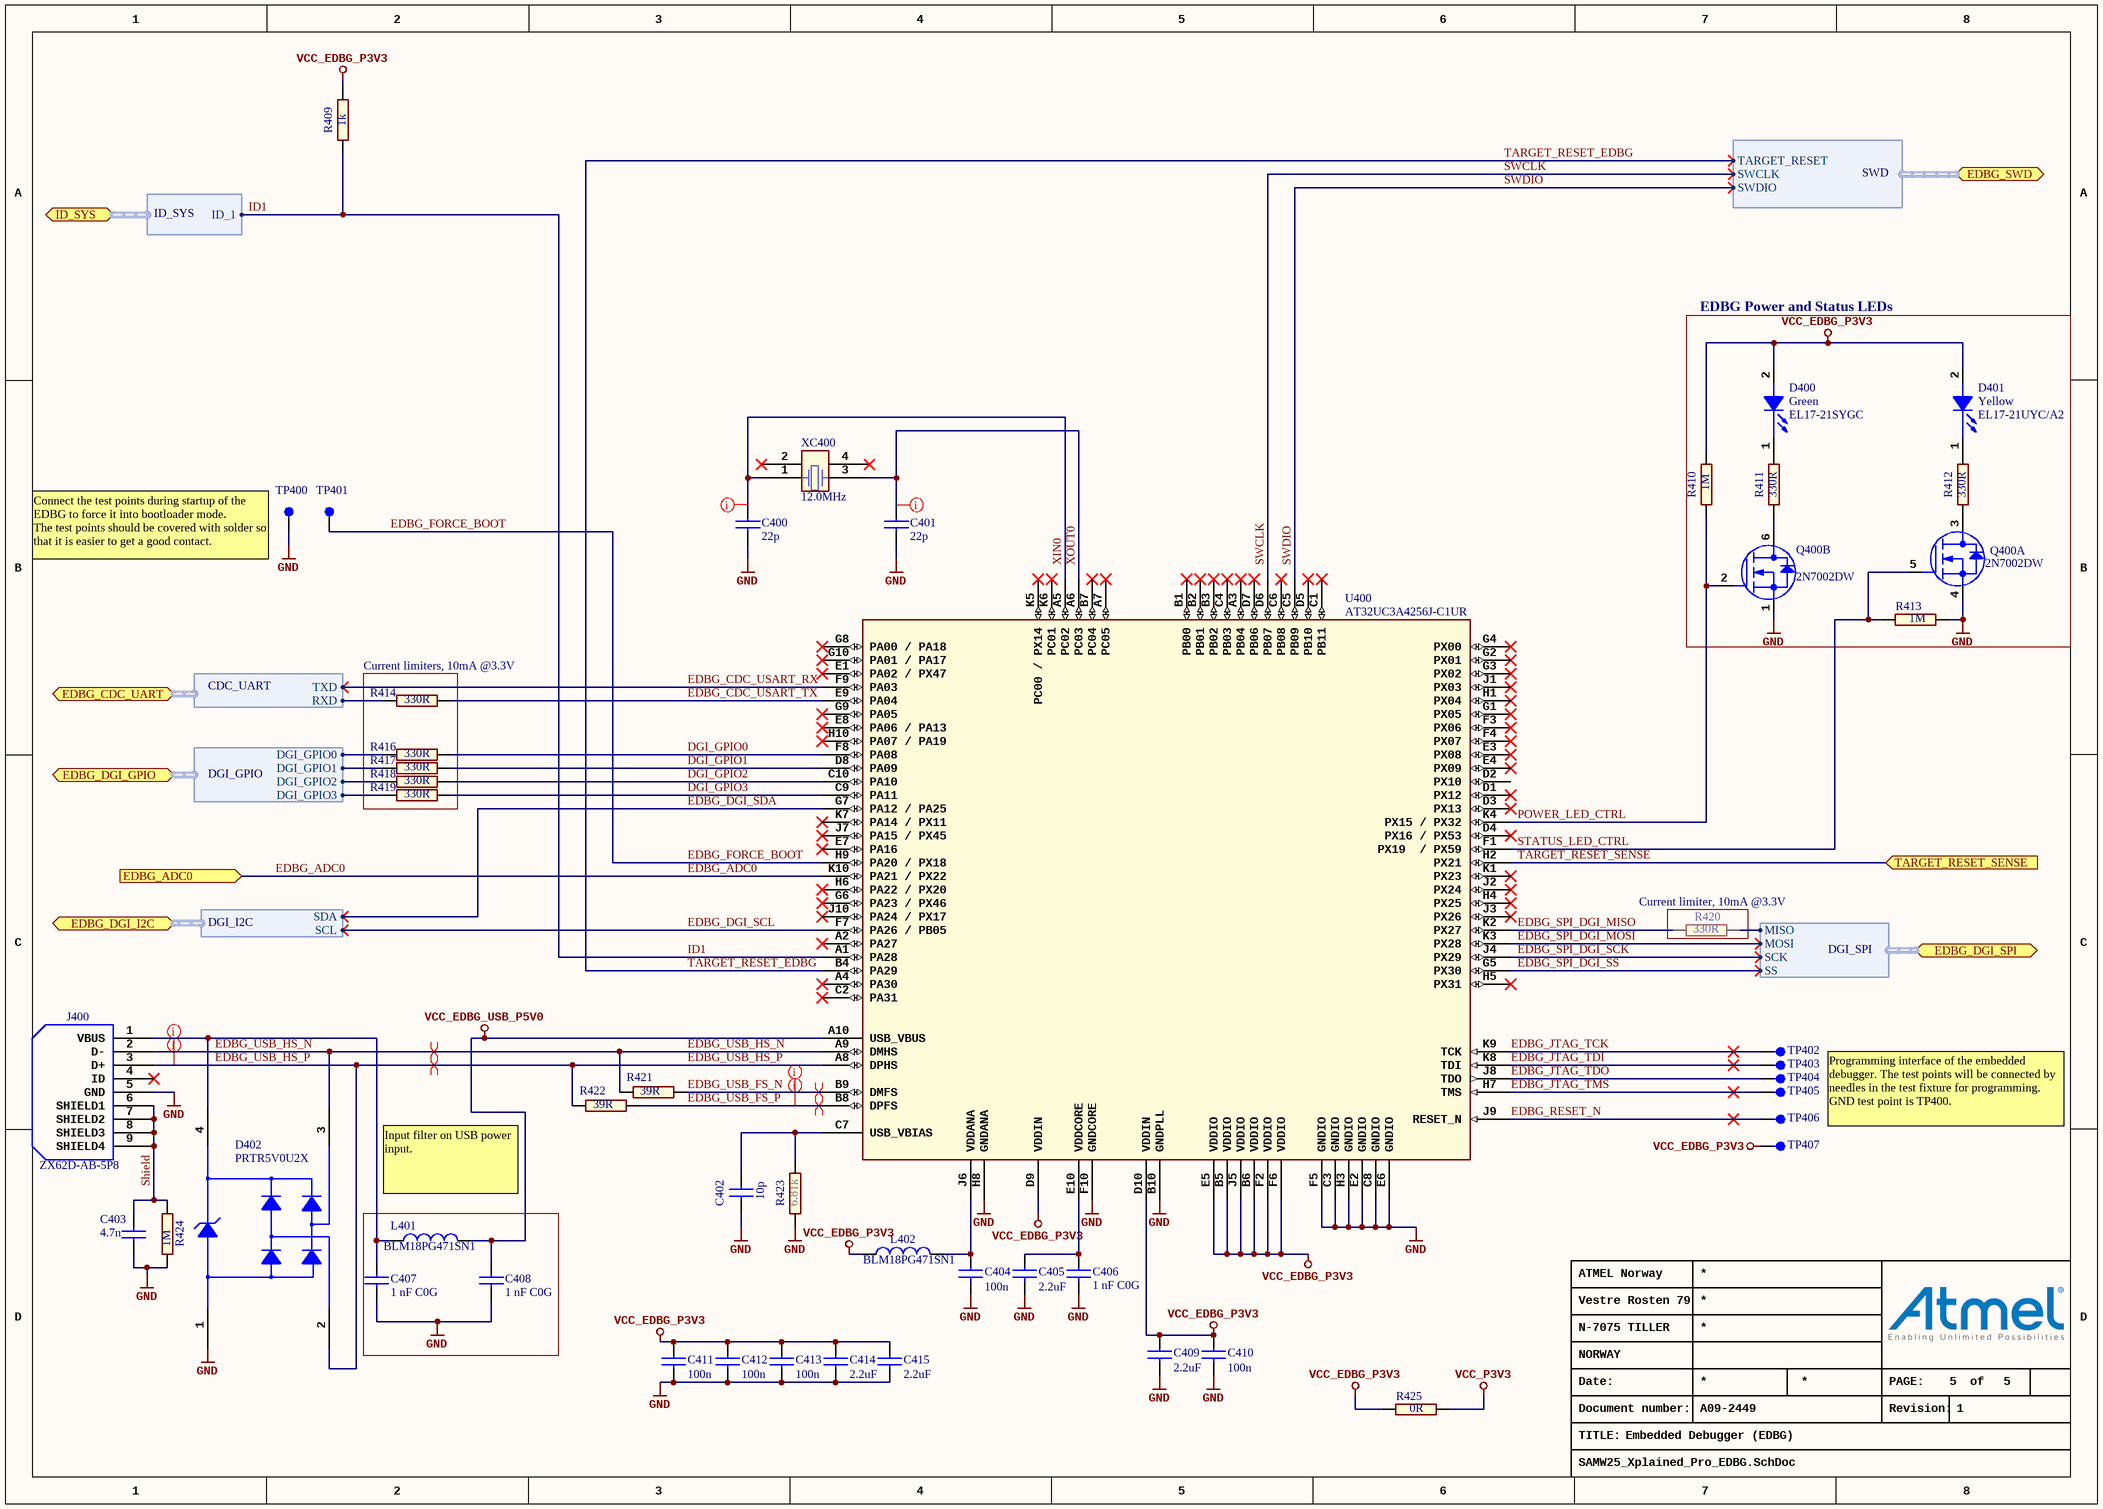
[diagram p2: SAMW25_Xplained_Pro_EDBG.SchDoc]

### Parts
C400  22p  [AP1-00053]
C401  22p  [AP1-00053]
C402  10p  [AP1-00053]
C403  value 4.7n  [AP1-00053]  (hidden comment: CAP-NONPOL)
C404  100n  [AP1-00053]
C405  value 2.2uF  [AP1-00053]  (hidden comment: Farnell no: 1288200)
C406  1 nF C0G  [AP1-00053]
C407  1 nF C0G  [AP1-00053]
C408  1 nF C0G  [AP1-00053]
C409  value 2.2uF  [AP1-00053]  (hidden comment: Farnell no: 1288200)
C410  100n  [AP1-00053]
C411  100n  [AP1-00053]
C412  100n  [AP1-00053]
C413  100n  [AP1-00053]
C414  value 2.2uF  [AP1-00053]  (hidden comment: Farnell no: 1288200)
C415  value 2.2uF  [AP1-00053]  (hidden comment: Farnell no: 1288200)
D400  Green  value EL17-21SYGC  [AP4-00013]
D401  Yellow  value EL17-21UYC/A2  [AP4-00013]
D402  PRTR5V0U2X  [AP4-00001]
J400  value ZX62D-AB-5P8  [AP8-00852]  (hidden comment: 2,000 pieces per reel)
L401  BLM18PG471SN1  [AP3-00005]
L402  BLM18PG471SN1  [AP3-00005]
Q400  value 2N7002DW  [AP5-00001]  (hidden comment: Same as 2N7002 but with two MOSFETs in one package)  (parts A,B of 2)
R409  value 1k  [AP2-00000]  (hidden comment: R2)
R410  value 1M  [AP2-00000]  (hidden comment: R2)
R411  value 330R  [AP2-00000]  (hidden comment: R2)
R412  value 330R  [AP2-00000]  (hidden comment: R2)
R413  value 1M  [AP2-00000]  (hidden comment: R2)
R414  value 330R  [AP2-00000]  (hidden comment: R2)
R416  value 330R  [AP2-00000]  (hidden comment: R2)
R417  value 330R  [AP2-00000]  (hidden comment: R2)
R418  value 330R  [AP2-00000]  (hidden comment: R2)
R419  value 330R  [AP2-00000]  (hidden comment: R2)
R420  value 330R  [AP2-00000]  (hidden comment: R2)
R421  value 39R  [AP2-00011]  (hidden comment: R2)
R422  value 39R  [AP2-00011]  (hidden comment: R2)
R423  value 6.81k  [AP2-00011]  (hidden comment: R2)
R424  value 1M  [AP2-00011]  (hidden comment: R2)
R425  value 0R  [AP2-00011]  (hidden comment: R2)
TP400  TESTPOINT  [AP8-00010]  (value not drawn)  (no BOM)
TP401  TESTPOINT  [AP8-00010]  (value not drawn)  (no BOM)
TP402  TESTPOINT  [AP8-00010]  (value not drawn)  (no BOM)
TP403  TESTPOINT  [AP8-00010]  (value not drawn)  (no BOM)
TP404  TESTPOINT  [AP8-00010]  (value not drawn)  (no BOM)
TP405  TESTPOINT  [AP8-00010]  (value not drawn)  (no BOM)
TP406  TESTPOINT  [AP8-00010]  (value not drawn)  (no BOM)
TP407  TESTPOINT  [AP8-00010]  (value not drawn)  (no BOM)
U400  value AT32UC3A4256J-C1UR  [AP6-00206]  (hidden comment: 100 ball VFBGA)
XC400  12.0MHz  [AP7-00039]

### Blocks framed on the sheet
EDBG Power and Status LEDs: D400 D401 Q400 R410-R413
Current limiters, 10mA @3.3V: R414 R416-R419

### Ports
EDBG_ADC0 (in), EDBG_CDC_UART (harness CDC_UART), EDBG_DGI_GPIO (harness DGI_GPIO), EDBG_DGI_I2C (harness DGI_I2C), EDBG_DGI_SPI (harness DGI_SPI), EDBG_SWD (harness SWD), ID_SYS (harness ID_SYS), TARGET_RESET_SENSE (in)

### Harnesses
CDC_UART: TXD, RXD
DGI_SPI: MISO, MOSI, SCK, SS
DGI_GPIO: DGI_GPIO0, DGI_GPIO1, DGI_GPIO2, DGI_GPIO3
ID_SYS: ID_1
SWD: SWCLK, SWDIO, TARGET_RESET
DGI_I2C: SCL, SDA

### Nets
GND: C400.2 C401.2 C402.2 C403.1 C404.2 C405.2 C406.2 C407.2 C408.2 C409.2 C410.2 C411.2 C412.2 C413.2 C414.2 C415.2 D402.1(GND) J400.5(GND) Q400.1(S2) Q400.4(S1) R413.1 R423.1 R424.1 TP400.1 U400.B10(GNDPLL) U400.C3(GNDIO) U400.C8(GNDIO) U400.E2(GNDIO) U400.E6(GNDIO) U400.F5(GNDIO) U400.F10(GNDCORE) U400.H3(GNDIO) U400.H8(GNDANA)
VCC_EDBG_P3V3: C409.1 C410.1 C411.1 C412.1 C413.1 C414.1 C415.1 D400.2(ANODE) D401.2(ANODE) L402.1 R409.2 R410.2 R425.1 TP407.1 U400.B5(VDDIO) U400.B6(VDDIO) U400.D9(VDDIN) U400.D10(VDDIN) U400.E5(VDDIO) U400.F2(VDDIO) U400.F6(VDDIO) U400.J5(VDDIO)
VCC_EDBG_USB_P5V0: C408.1 L401.2 U400.A10(USB_VBUS)
VCC_P3V3: R425.2
DGI_GPIO0: R416.2 U400.F8(PA08)
DGI_GPIO1: R417.2 U400.D8(PA09)
DGI_GPIO2: R418.2 U400.C10(PA10)
DGI_GPIO3: R419.2 U400.C9(PA11)
EDBG_ADC0: U400.K10(PA21_/_PX22) ; port EDBG_ADC0
EDBG_CDC_USART_RX: U400.F9(PA03) ; port EDBG_CDC_UART.TXD
EDBG_CDC_USART_TX: R414.2 U400.E9(PA04)
EDBG_DGI_SCL: U400.F7(PA26_/_PB05) ; port EDBG_DGI_I2C.SCL
EDBG_DGI_SDA: U400.G7(PA12_/_PA25) ; port EDBG_DGI_I2C.SDA
EDBG_FORCE_BOOT: TP401.1 U400.H9(PA20_/_PX18)
EDBG_JTAG_TCK: TP402.1 U400.K9(TCK)
EDBG_JTAG_TDI: TP403.1 U400.K8(TDI)
EDBG_JTAG_TDO: TP404.1 U400.J8(TDO)
EDBG_JTAG_TMS: TP405.1 U400.H7(TMS)
EDBG_RESET_N: TP406.1 U400.J9(RESET_N)
EDBG_SPI_DGI_MISO: R420.1 U400.K2(PX27)
EDBG_SPI_DGI_MOSI: U400.K3(PX28) ; port EDBG_DGI_SPI.MOSI
EDBG_SPI_DGI_SCK: U400.J4(PX29) ; port EDBG_DGI_SPI.SCK
EDBG_SPI_DGI_SS: U400.G5(PX30) ; port EDBG_DGI_SPI.SS
EDBG_USB_FS_N: R421.2 U400.B9(DMFS)
EDBG_USB_FS_P: R422.2 U400.B8(DPFS)
EDBG_USB_HS_N: D402.3(I/O_2) J400.2(D-) R421.1 U400.A9(DMHS)
EDBG_USB_HS_P: D402.2(I/O_1) J400.3(D+) R422.1 U400.A8(DPHS)
ID1: R409.1 U400.A1(PA28) ; port ID_SYS.ID_1
PA16_S1_SPI_MISO: R420.2 ; port EDBG_DGI_SPI.MISO
PA22_TC4_0: R418.1 ; port EDBG_DGI_GPIO.DGI_GPIO2
PA23_PWM_TC4_1: R419.1 ; port EDBG_DGI_GPIO.DGI_GPIO3
PB11_S4_UART_RX: R414.1 ; port EDBG_CDC_UART.RXD
PB22_GPIO1: R416.1 ; port EDBG_DGI_GPIO.DGI_GPIO0
PB23_GPIO2: R417.1 ; port EDBG_DGI_GPIO.DGI_GPIO1
POWER_LED_CTRL: Q400.2(G2) R410.1 U400.K4(PX15_/_PX32)
Shield: C403.2 J400.6(SHIELD1) J400.7(SHIELD2) J400.8(SHIELD3) J400.9(SHIELD4) R424.2
STATUS_LED_CTRL: Q400.5(G1) R413.2 U400.F1(PX19__/_PX59)
SWCLK: U400.D6(PB07) ; port EDBG_SWD.SWCLK
SWDIO: U400.C5(PB09) ; port EDBG_SWD.SWDIO
TARGET_RESET_EDBG: U400.B4(PA29) ; port EDBG_SWD.TARGET_RESET  [project net TARGET_RESET]
TARGET_RESET_SENSE: U400.H2(PX21) ; port TARGET_RESET_SENSE
XIN0: C400.1 U400.A5(PC02) XC400.1
XOUT0: C401.1 U400.A6(PC03) XC400.3
NetC402_1: C402.1 R423.2 U400.C7(USB_VBIAS)
NetC404_1: C404.1 L402.2 U400.J6(VDDANA)
NetC405_1: C405.1 C406.1 U400.E10(VDDCORE)
NetC407_1: C407.1 D402.4(VCC) J400.1(VBUS) L401.1
NetD400_1: D400.1(CATHODE) R411.2
NetD401_1: D401.1(CATHODE) R412.2
NetQ400_3: Q400.3(D1) R412.1
NetQ400_6: Q400.6(D2) R411.1

Not connected (* = marked no-connect by the designer): J400 4(ID)*; U400 A2(PA27)* A3(PB04)* A4(PA30)* A7(PC05)* B1(PB00)* B2(PB01)* B3(PB02)* B7(PC04)* C1(PB11)* C2(PA31)* C4(PB03)* C6(PB08)* D1(PX12)* D2(PX10) D3(PX13)* D4(PX16_/_PX53)* D5(PB10)* D7(PB06)* E1(PA02_/_PX47)* E3(PX08)* E4(PX09)* E7(PA16)* E8(PA06_/_PA13)* F3(PX06)* F4(PX07)* G1(PX05)* G2(PX01)* G3(PX02)* G4(PX00)* G6(PA23_/_PX46)* G8(PA00_/_PA18)* G9(PA05)* G10(PA01_/_PA17)* H1(PX04)* H4(PX25)* H5(PX31)* H6(PA22_/_PX20)* H10(PA07_/_PA19)* J1(PX03)* J2(PX24)* J3(PX26)* J7(PA15_/_PX45)* J10(PA24_/_PX17)* K1(PX23)* K5(PC00_/_PX14)* K6(PC01)* K7(PA14_/_PX11)*; XC400 2* 4*

### Layout directives
differential pair: EDBG_USB_FS_N, EDBG_USB_FS_P, EDBG_USB_HS_N, EDBG_USB_HS_P
rule Assembly Testpoint Usage [Testpoint - Not Allowed    Multiple - Not Allowed]: EDBG_USB_FS_N, EDBG_USB_FS_P, EDBG_USB_HS_N, EDBG_USB_HS_P, XIN0, XOUT0

### Notes on the sheet
- (near TP400) Connect the test points during startup of the EDBG to force it into bootloader mode.
  The test points should be covered with solder so that it is easier to get a good contact.
- (near R420) Current limiter, 10mA @3.3V
- Programming interface of the embedded debugger. The test points will be connected by needles in the test fixture for programming. GND test point is TP400.
- Input filter on USB power input.
- Date:
- PAGE:
- of
- TITLE:
- Document number:
- Revision:

### Library data of the parts
C400 C401 = A01-0019: Ceramic capacitor, SMD 0402, NP0, 50V, +/-5%; PartGroup: Capacitors,Ceramic,SMD 0402; TemperatureRange: -55 - +125 deg C; ComponentStatus: 'Active (verified)'; Status: Active; Verified by: Lars Helge Mo; Verified date: 2005-12-15; AN: A01-0019; Value: 22p; Tolerance: 50V, +/-5%; Height: 0,550000011920929; FootprintStatus: 'Active (Verified)'
C402 = A01-0015: Ceramic capacitor, SMD 0402, NP0, 50V, +/-5%; PartGroup: Capacitors,Ceramic,SMD 0402; TemperatureRange: -55 - +125 deg C; ComponentStatus: 'Active (verified)'; Status: Active; Verified by: Lars Helge Mo; Verified date: 2005-12-15; AN: A01-0015; Value: 10p; Tolerance: 50V, +/-5%; Height: 0,550000011920929; FootprintStatus: 'Active (Verified)'
C403 = A01-0046: Ceramic capacitor, SMD 0402, X7R, 25V, +/-10%; PartGroup: Capacitors,Ceramic,SMD 0402; TemperatureRange: -55 - +125 deg C; ComponentStatus: 'Active (verified)'; Status: Active; Verified by: Lars Helge Mo; Verified date: 2005-12-15; AN: A01-0046; Tolerance: 25V, +/-10%; Height: 0.550000011920929; FootprintStatus: 'Active (Verified)'
C404 C410-C413 = A01-0246: as C306 on sheet SAMW25_Xplained_Pro_WIFI_module; Status: Active; Verified by: Lars Helge Mo; Verified date: 2005-12-15; AN: A01-0246; Value: 100n; Tolerance: 16V, +/-10%; Height: 0,5; FootprintStatus: 'Active (Verified)'
C405 C409 C414 C415 = A01-0300: Ceramic capacitor, SMD 0402, X5R, 6.3V, +/-20%; PartGroup: Capacitors,Ceramic,SMD 0402; Manufacturer: Kemet; MPN: C0402C225M9PAC; Tolerance: ±20%; TemperatureRange: -55°C to +85°C; ComponentStatus: 'Active (verified)'; Status: Active; Verified by: Lars Helge Mo; Verified date: 2005-12-15; AN: A01-0300; Height: 0,5; FootprintStatus: 'Active (Verified)'
C406-C408 = A01-0321: Ceramic capacitor, SMD 0402, C0G, 50V, +/-5%; PartGroup: Capacitors,Ceramic,SMD 0402; Manufacturer: Murata; MPN: GRM1555C1H102JA01D; Tolerance: 5%; ComponentStatus: 'Active (verified)'; Status: Active; Verified by: Lars Helge Mo; Verified date: 2005-12-15; AN: A01-0321; Value: 1 nF C0G; FootprintStatus: 'Active (Verified)'
D400 = A10-0018: LED, Green, Wave length=575nm, SMD 0805, ±70°; PartGroup: Opto,LEDs,SMD; Manufacturer: Everlight; TemperatureRange: -40 - +85 deg C; ComponentStatus: 'Active (verified)'; Verified date: 2006-02-17; Verified by: Sveinung Helgeland; Status: Active; AN: A10-0018; Height: 1,10000002384186; MPN: EL17-21SYGC; FootprintStatus: 'Active (Verified)'
D401 = A10-0019: as D301 on sheet SAMW25_Xplained_Pro_WIFI_module; Verified date: 2006-02-17; Verified by: Sveinung Helgeland; Status: Active; AN: A10-0019; Height: 1,10000002384186; FootprintStatus: 'Active (Verified)'
D402 = A06-0236: Double rail-to-rail USB ESD protection diode; OrcadPartType: Integrated Circuits&Special function&Protection; Manufacturer: Philips; TemperatureRange: -40 to +85 C; ComponentStatus: 'Active (verified)'; Status: Active; Verified by: Lars Nordin; Verified date: 2007-08-13; AN: A06-0236; Value: PRTR5V0U2X; PartType: Buy; Height: 1,10000002384186; MPN: PRTR5V0U2X; FootprintStatus: 'Active (Verified)'
J400 = A08-2112: Micro USB AB Connector, Standard SMT + DIP; PartGroup: Mechanical devices,Connectors,USB; ComponentStatus: 'Active (verified)'; Verified date: 2006-05-18; Verified by: Eirik Rasmussen; Status: Active; AN: A08-2112; Height: 2.79999995231628; FootprintStatus: 'New (Not verified)'
L401 L402 = A03-0035: SMD RF inductor 0603. Z=470Ohm (@100MHz), Max R(dc)=0.65Ohm, Max current=1A; PartGroup: Inductors,EMI; Manufacturer: Murata; Tolerance: ±25%; TemperatureRange: -55°C to +125°C; ComponentStatus: 'Active (verified)'; Verified date: 2006-01-30; Verified by: Lars Helge Mo; Status: Active; AN: A03-0035; Value: BLM18PG471SN1; Height: 0,800000011920929; MPN: BLM18PG471SN1; FootprintStatus: 'Active (Verified)'
Q400 = A05-0051: Dual N-Channel MOSFET, 60V, 115mA cont,RDS(ON) < 7.5 Ohm @50mA@5V, SOT-363; PartGroup: Transistors,Small signal FET,SMD; Manufacturer: Fairchild; TemperatureRange: -65 to 150 deg C; ComponentStatus: 'Active (verified)'; Status: New; AN: A05-0051; Height: 1,10000002384186; MPN: 2N7002DW; FootprintStatus: 'Active (Verified)'
R409 = A02-0212: as R304 on sheet SAMW25_Xplained_Pro_WIFI_module; Status: Active; Verified by: Lars Helge Mo; Verified date: 2005-12-19; AN: A02-0212; Tolerance: 1 %; Height: 0.349999994039536; FootprintStatus: 'Active (Verified)'
R410 R413 R424 = A02-0284: Thick film resistor, SMD 0402, 1/16W, 1%; PartGroup: Resistors,SMD,0402 1%; Manufacturer: KOA; MPN: RK73H1ETTP1004F; TemperatureRange: -55 - +125 deg C; ComponentStatus: 'Active (verified)'; Status: Active; Verified by: Lars Helge Mo; Verified date: 2005-12-19; AN: A02-0284; Tolerance: 1 %; FootprintStatus: 'Active (Verified)'
  R410 R413: Height: 0.349999994039536
  R424: Height: 0,349999994039536
R411 R412 R414 R416-R420 = A02-0200: as R310 on sheet SAMW25_Xplained_Pro_WIFI_module; Status: Active; Verified by: Lars Helge Mo; Verified date: 2005-12-19; AN: A02-0200; Tolerance: 1 %; FootprintStatus: 'Active (Verified)'
  R411 R412: Height: 0.349999994039536
  R414 R416-R420: Height: 0,349999994039536
R421 R422 = A02-0178: as R302 on sheet SAMW25_Xplained_Pro_WIFI_module; Status: Active; Verified by: Lars Helge Mo; Verified date: 2005-12-19; AN: A02-0178; Tolerance: 1 %; Height: 0,349999994039536; FootprintStatus: 'Active (Verified)'
R423 = A02-0539: Thick film resistor, SMD 0402, 1/16W, 1%; PartGroup: Resistors,SMD,0402 1%; TemperatureRange: -55 - +125 deg C; ComponentStatus: 'Active (verified)'; Status: Active; Verified by: Lars Helge Mo; Verified date: 2005-12-19; AN: A02-0539; Tolerance: 1%; Height: 0,349999994039536; FootprintStatus: 'Active (Verified)'
R425 = A02-0163: as R324 on sheet SAMW25_Xplained_Pro_WIFI_module; Status: Active; Verified by: Lars Helge Mo; Verified date: 2005-12-19; AN: A02-0163; Tolerance: 1 %; Height: 0.349999994039536; FootprintStatus: 'Active (Verified)'
TP400-TP407 = A08-0004: as TP307 on sheet SAMW25_Xplained_Pro_WIFI_module; Status: Active; Verified by: Sveinung Helgeland; Verified date: 2006-02-17; AN: A08-0004; Height: 0; FootprintStatus: 'Active (Verified)'
U400 = A06-0736: AVR 32-bit RISC MCU; PartGroup: Integrated Circuits,MCU, MPU, DSP,AVR MCU; Manufacturer: ATMEL; TemperatureRange: -40 to +85 deg C; ComponentStatus: 'Active (verified)'; Status: Not verified; AN: A06-0736; Height: 1; MPN: AT32UC3A4256J-C1UR; FootprintStatus: 'Active (Verified)'
XC400 = A07-0042: Fox FQ5032B 12.0MHz SMD crystal 738B-12; PartGroup: Frequency devices,Crystals,SMD; Manufacturer: Fox  Electronics; MPN: FQ5032B-12-C-C-C-200-1; Tolerance: 30PPM; ComponentStatus: 'Active (verified)'; Status: Active; Verified by: Ketil Skjerve; Verified date: 2007-06-15; AN: A07-0042; Value: 12.0MHz; Height: 1,20000004768372; FootprintStatus: 'Active (Verified)'

## Sheet SAMW25_Xplained_Pro_Connectors.SchDoc: Extension connectors
size A3; Organization: ATMEL Norway; Address1: Vestre Rosten 79; Address2: N-7075 TILLER; Address3: NORWAY; DocumentNumber: A09-2449; Revision: 1; SheetNumber: 4; SheetTotal: 5; PageSetup: Record=PageOptions|CenterHorizontal=True|CenterVertical=True|PrintScale=1.01|XCorrection=1.00|YCorrection=1.00|PrintKind=1|BorderSize=5000000|LeftOffset=0|BottomOffset=0|Orientation=2|PaperLength=1000|PaperWidth=1000|Scale=100|PaperSource=7|PrintQuality=-4|MediaType=1|DitherType=10|PaperKind=A3 (297 x 420 mm)|PrintScaleMode=1
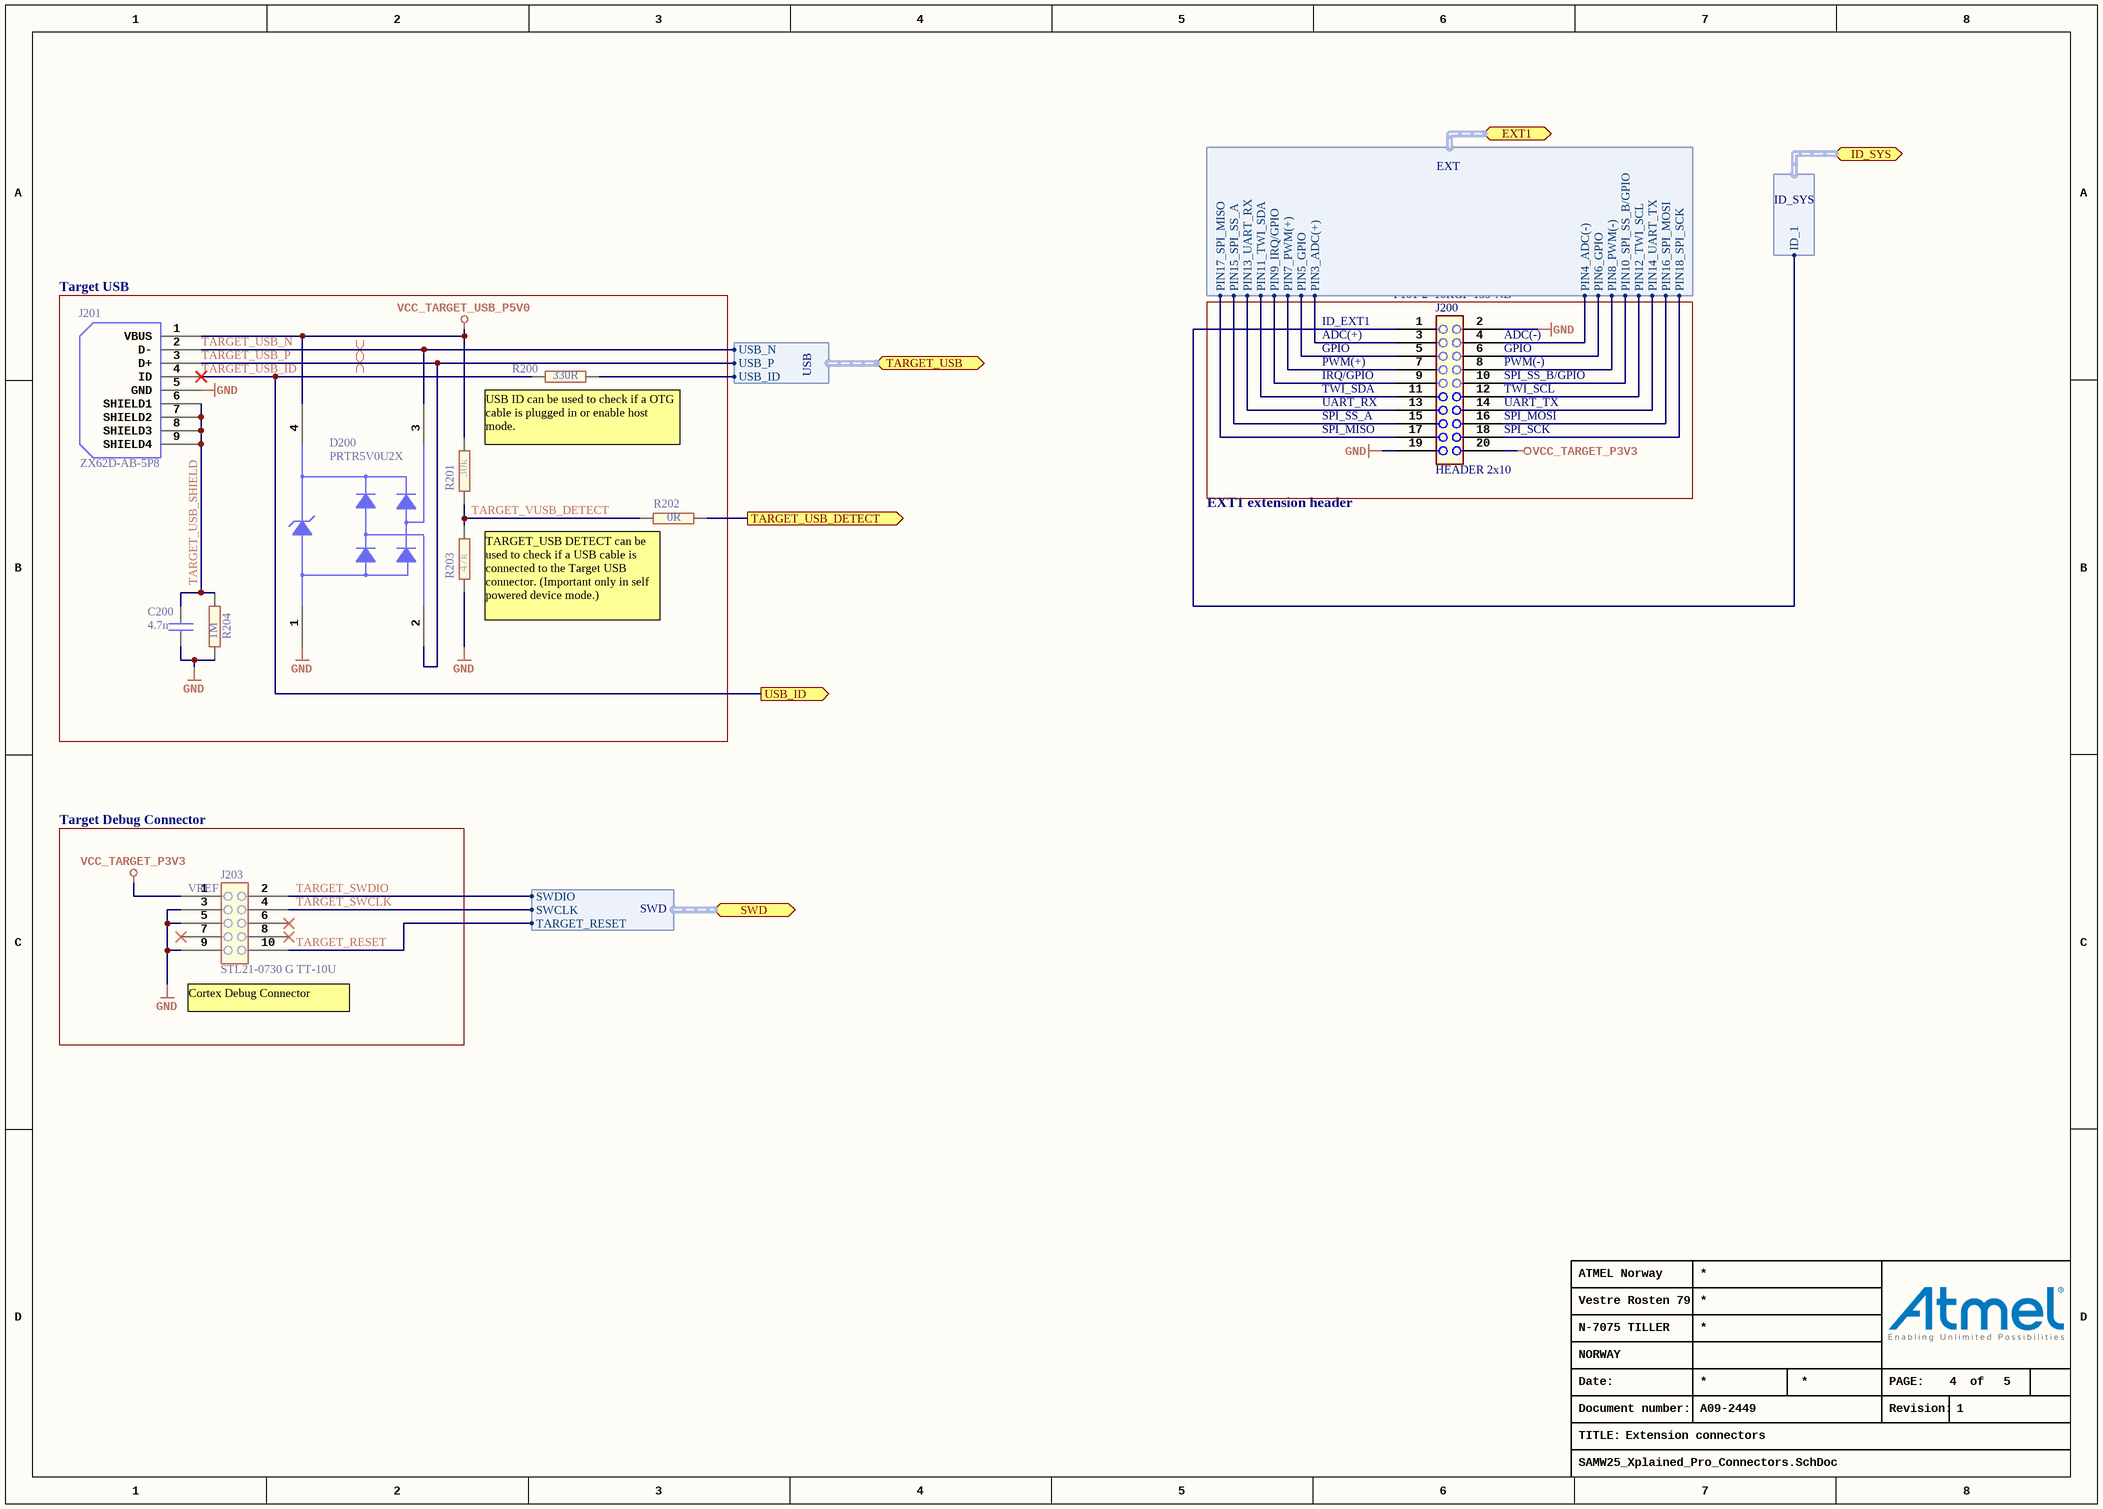
[diagram p3: SAMW25_Xplained_Pro_Connectors.SchDoc]

### Parts
C200  value 4.7n  [AP1-00053]  (hidden comment: CAP-NONPOL)
D200  PRTR5V0U2X  [AP4-00001]
J200  HEADER 2x10  value P101-2*10RGF-139-ND  [AP8-00622]
J201  value ZX62D-AB-5P8  [AP8-00852]  (hidden comment: 2,000 pieces per reel)
J203  MPN: STL21-0730 G TT-10U  [AP8-00257]  (hidden comment: HEADER 2x5)
R200  value 330R  [AP2-00000]  (hidden comment: R2)
R201  value 30k  [AP2-00011]  (hidden comment: R2)
R202  value 0R  [AP2-00000]  (hidden comment: R2)
R203  value 47k  [AP2-00011]  (hidden comment: R2)
R204  value 1M  [AP2-00011]  (hidden comment: R2)

### Blocks framed on the sheet
Target USB: C200 D200 J201 R200-R204
Target Debug Connector: J203

### Ports
EXT1 (harness EXT), ID_SYS (harness ID_SYS), SWD (harness SWD), TARGET_USB (harness USB), TARGET_USB_DETECT (out), USB_ID (out)

### Harnesses
ID_SYS: ID_1
EXT: PIN3_ADC(+), PIN4_ADC(-), PIN5_GPIO, PIN6_GPIO, PIN7_PWM(+), PIN8_PWM(-), PIN9_IRQ/GPIO, PIN10_SPI_SS_B/GPIO, PIN11_TWI_SDA, PIN12_TWI_SCL, PIN13_UART_RX, PIN14_UART_TX, PIN15_SPI_SS_A, PIN16_SPI_MOSI, PIN17_SPI_MISO, PIN18_SPI_SCK
USB: USB_P, USB_N, USB_ID
SWD: SWCLK, SWDIO, TARGET_RESET

### Nets
GND: C200.1 D200.1(GND) J200.2 J200.19 J201.5(GND) J203.3 J203.5 J203.9 R203.1 R204.1
VCC_TARGET_P3V3: J200.20 J203.1
VCC_TARGET_USB_P5V0: D200.4(VCC) J201.1(VBUS) R201.2
EDBG_CDC_USART_RX: J200.14 ; port EXT1.PIN14_UART_TX
EDBG_DGI_SCL: J200.12 ; port EXT1.PIN12_TWI_SCL
EDBG_DGI_SDA: J200.11 ; port EXT1.PIN11_TWI_SDA
EDBG_SPI_DGI_MOSI: J200.16 ; port EXT1.PIN16_SPI_MOSI
EDBG_SPI_DGI_SCK: J200.18 ; port EXT1.PIN18_SPI_SCK
ID1: J200.1 ; port ID_SYS.ID_1
PA02_ADC0: J200.3 ; port EXT1.PIN3_ADC(+)
PA03_ADC1: J200.4 ; port EXT1.PIN4_ADC(-)
PA04_ADC4: R200.2 ; port TARGET_USB.USB_ID
PA05_ADC5: R202.2 ; port TARGET_USB_DETECT
PA10_PWM_TC0_2: J200.7 ; port EXT1.PIN7_PWM(+)
PA11_PWM_TC0_3: J200.8 ; port EXT1.PIN8_PWM(-)
PA16_S1_SPI_MISO: J200.17 ; port EXT1.PIN17_SPI_MISO
PA17_S1_SPI_SS: J200.15 ; port EXT1.PIN15_SPI_SS_A
PA20_GPIO_IRQ4: J200.9 ; port EXT1.PIN9_IRQ/GPIO
PA21_GPIO_SS: J200.10 ; port EXT1.PIN10_SPI_SS_B/GPIO
PB02_GPIO1: J200.5 ; port EXT1.PIN5_GPIO
PB03_GPIO2: J200.6 ; port EXT1.PIN6_GPIO
PB11_S4_UART_RX: J200.13 ; port EXT1.PIN13_UART_RX
TARGET_RESET: J203.10 ; port SWD.TARGET_RESET
TARGET_SWCLK: J203.4 ; port SWD.SWCLK  [project net SWCLK]
TARGET_SWDIO: J203.2 ; port SWD.SWDIO  [project net SWDIO]
TARGET_USB_ID: J201.4(ID) R200.1 ; port USB_ID
TARGET_USB_N: D200.3(I/O_2) J201.2(D-) ; port TARGET_USB.USB_N
TARGET_USB_P: D200.2(I/O_1) J201.3(D+) ; port TARGET_USB.USB_P
TARGET_USB_SHIELD: C200.2 J201.6(SHIELD1) J201.7(SHIELD2) J201.8(SHIELD3) J201.9(SHIELD4) R204.2
TARGET_VUSB_DETECT: R201.1 R202.1 R203.2

Not connected (* = marked no-connect by the designer): J203 6* 7* 8*

### Layout directives
differential pair: TARGET_USB_N, TARGET_USB_P

### Notes on the sheet
- ID_EXT1
- ADC(+)
- GPIO
- PWM(+)
- IRQ/GPIO
- (near J200) ADC(-)
- (near J200) GPIO
- (near J200) PWM(-)
- (near J200) SPI_SS_B/GPIO
- USB ID can be used to check if a OTG cable is plugged in or enable host mode.
- TWI_SDA
- UART_RX
- SPI_SS_A
- SPI_MISO
- (near J200) TWI_SCL
- (near J200) UART_TX
- (near J200) SPI_MOSI
- (near J200) SPI_SCK
- EXT1 extension header
- TARGET_USB DETECT can be used to check if a USB cable is connected to the Target USB connector. (Important only in self powered device mode.)
- (near J203) VREF
- (near J203) Cortex Debug Connector
- Date:
- PAGE:
- of
- TITLE:
- Document number:
- Revision:

### Library data of the parts
C200 = A01-0046: as C403 on sheet SAMW25_Xplained_Pro_EDBG; Status: Active; Verified by: Lars Helge Mo; Verified date: 2005-12-15; AN: A01-0046; Tolerance: 25V, +/-10%; Height: 0.550000011920929; FootprintStatus: 'Active (Verified)'
D200 = A06-0236: as D402 on sheet SAMW25_Xplained_Pro_EDBG; Status: Active; Verified by: Lars Nordin; Verified date: 2007-08-13; AN: A06-0236; Value: PRTR5V0U2X; PartType: Buy; Height: 1,10000002384186; MPN: PRTR5V0U2X; FootprintStatus: 'Active (Verified)'
J200 = A08-1513: Pin header, 2x10, Right Angle, 2.54mm, THM, Pin In Paste; PartGroup: Mechanical devices,Connectors,Pin headers; ComponentStatus: 'New (not verified)'; Status: Active; Verified by: Lars Helge Mo; Verified date: 2005-12-19; AN: A08-1513; MPN: P101-2*10RGF-139-ND; FootprintStatus: 'Active (Verified)'
J201 = A08-2112: as J400 on sheet SAMW25_Xplained_Pro_EDBG; Verified date: 2006-05-18; Verified by: Eirik Rasmussen; Status: Active; AN: A08-2112; Height: 2.79999995231628; FootprintStatus: 'New (Not verified)'
J203 = A08-0385: 2x5 pin header, 1.27mm pitch, THM; PartGroup: Mechanical devices,Connectors,Pin headers; Manufacturer: Garry; Value: PIN HEADER 2x5; ComponentStatus: 'Active (verified)'; Verified date: 2005-12-19; Verified by: Lars Helge Mo; Status: Active; AN: A08-0385; Height: 7.30000019073486; FootprintStatus: 'Active (Verified)'
R200 = A02-0200: as R310 on sheet SAMW25_Xplained_Pro_WIFI_module; Status: Active; Verified by: Lars Helge Mo; Verified date: 2005-12-19; AN: A02-0200; Tolerance: 1 %; Height: 0.349999994039536; FootprintStatus: 'Active (Verified)'
R201 = A02-0247: Thick film resistor, SMD 0402, 1/16W, 1%; PartGroup: Resistors,SMD,0402 1%; TemperatureRange: -55 - +125 deg C; ComponentStatus: 'Active (verified)'; Status: Active; Verified by: Lars Helge Mo; Verified date: 2005-12-19; AN: A02-0247; Tolerance: 1 %; Height: 0.349999994039536; FootprintStatus: 'Active (Verified)'
R202 = A02-0163: as R314 on sheet SAMW25_Xplained_Pro_WIFI_module; Status: Active; Verified by: Lars Helge Mo; Verified date: 2005-12-19; AN: A02-0163; Height: 0,349999994039536; FootprintStatus: 'Active (Verified)'
R203 = A02-0252: Thick film resistor, SMD 0402, 1/16W, 1%; PartGroup: Resistors,SMD,0402 1%; TemperatureRange: -55 - +125 deg C; ComponentStatus: 'Active (verified)'; Status: Active; Verified by: Lars Helge Mo; Verified date: 2005-12-19; AN: A02-0252; Tolerance: 1 %; Height: 0.349999994039536; FootprintStatus: 'Active (Verified)'
R204 = A02-0284: as R410 on sheet SAMW25_Xplained_Pro_EDBG; Status: Active; Verified by: Lars Helge Mo; Verified date: 2005-12-19; AN: A02-0284; Tolerance: 1 %; Height: 0,349999994039536; FootprintStatus: 'Active (Verified)'